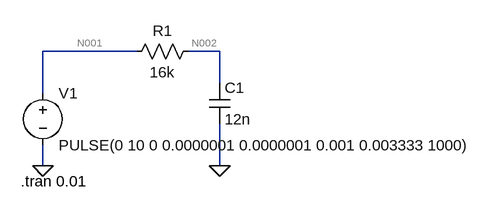
[diagram p0: schematic Ckt3_2_1.asc]
Ckt3_2_1.asc, the LTspice schematic file:
Version 4
SHEET 1 880 680
WIRE 224 64 80 64
WIRE 352 64 304 64
WIRE 352 112 352 64
WIRE 80 128 80 64
WIRE 80 240 80 208
WIRE 352 240 352 176
FLAG 80 240 0
FLAG 352 240 0
SYMBOL voltage 80 112 R0
WINDOW 123 0 0 Left 0
WINDOW 39 0 0 Left 0
SYMATTR InstName V1
SYMATTR Value PULSE(0 10 0 0.0000001 0.0000001 0.001 0.003333 1000)
SYMBOL res 320 48 R90
WINDOW 0 0 56 VBottom 2
WINDOW 3 32 56 VTop 2
SYMATTR InstName R1
SYMATTR Value 16k
SYMBOL cap 336 112 R0
SYMATTR InstName C1
SYMATTR Value 12n
TEXT 46 264 Left 2 !.tran 0.01

The netlist it stands for:
* Ckt3_2_1.asc
V1 N001 0 PULSE(0 10 0 0.0000001 0.0000001 0.001 0.003333 1000)
R1 N002 N001 16k
C1 N002 0 12n
.tran 0.01
.backanno
.end

* Results of the author's LTspice run, read from the files saved beside the schematic
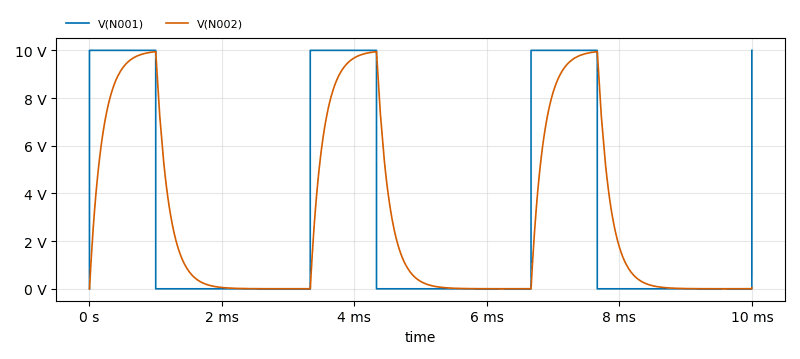
[diagram p1: Transient Analysis of Ckt3_2_1.asc, plotted from the saved traces]
* Transient Analysis, 1 run:
*   V(N001): min 0 V, max 10 V, average 3.001 V, rms 5.478 V, last 10 V
*   V(N002): min 0 V, max 9.945 V, average 3.002 V, rms 4.934 V, last 49.41 mV